# Altium project HALL_SENSOR_BOARD.PrjPCB
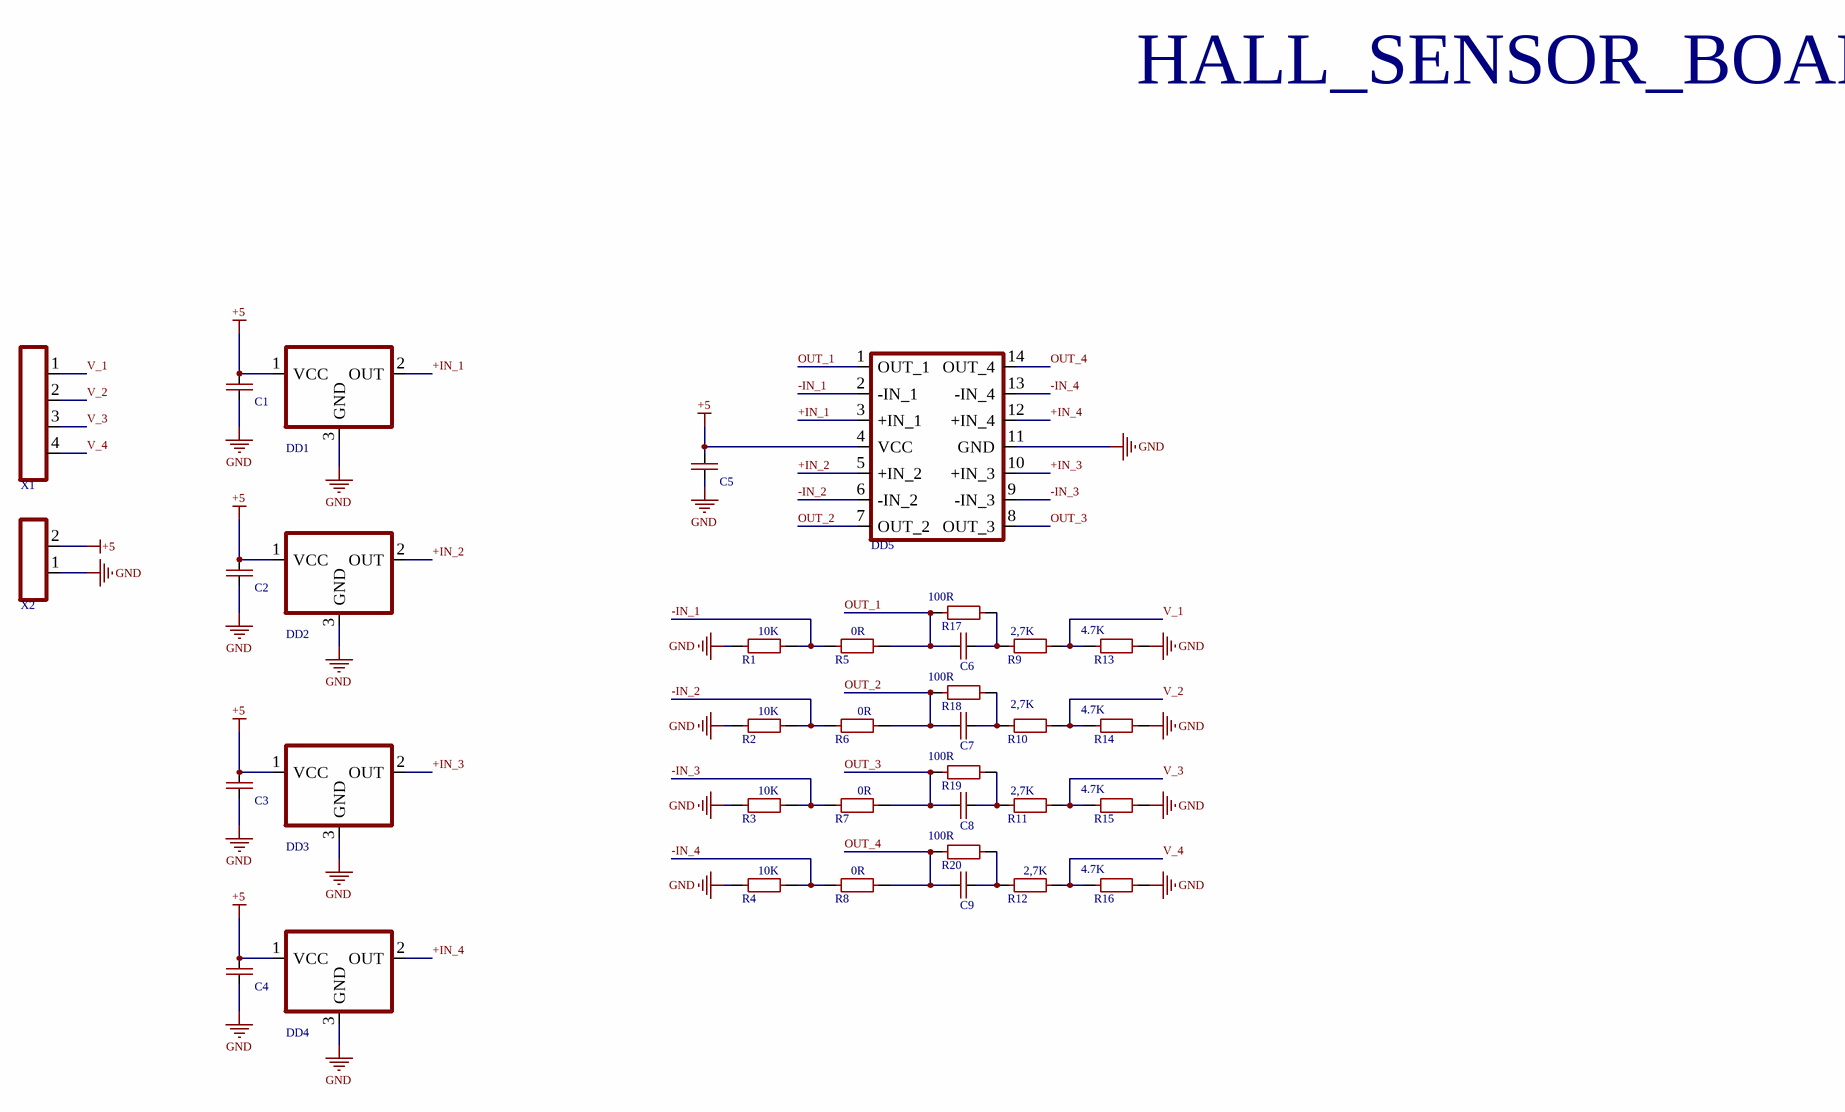
[diagram p0: HALL_SENSOR_BOARD.SchDoc]
1 sheet, 36 parts. Net scope: global (net labels, ports and power ports of the same name join across sheets).
Board file: HALL_SENSOR_BOARD.PcbDoc

## Sheet HALL_SENSOR_BOARD.SchDoc
size A1

### Parts
C1  CAP-NON-POLAR  [CAP-0805]  (value not drawn)
C2  CAP-NON-POLAR  [CAP-0805]  (value not drawn)
C3  CAP-NON-POLAR  [CAP-0805]  (value not drawn)
C4  CAP-NON-POLAR  [CAP-0805]  (value not drawn)
C5  CAP-NON-POLAR  [CAP-0805]  (value not drawn)
C6  CAP-NON-POLAR  [CAP-0805]  (value not drawn)
C7  CAP-NON-POLAR  [CAP-0805]  (value not drawn)
C8  CAP-NON-POLAR  [CAP-0805]  (value not drawn)
C9  CAP-NON-POLAR  [CAP-0805]  (value not drawn)
DD1  49E  [SOT23-3]  (value not drawn)
DD2  49E  [SOT23-3]  (value not drawn)
DD3  49E  [SOT23-3]  (value not drawn)
DD4  49E  [SOT23-3]  (value not drawn)
DD5  LM324  [SOIC14]  (value not drawn)
R1  10K  [RES-0603]
R2  10K  [RES-0603]
R3  10K  [RES-0603]
R4  10K  [RES-0603]
R5  0R  [RES-0603]
R6  0R  [RES-0603]
R7  0R  [RES-0603]
R8  0R  [RES-0603]
R9  2,7K  [RES-0603]
R10  2,7K  [RES-0603]
R11  2,7K  [RES-0603]
R12  2,7K  [RES-0603]
R13  4.7K  [RES-0603]
R14  4.7K  [RES-0603]
R15  4.7K  [RES-0603]
R16  4.7K  [RES-0603]
R17  100R  [RES-0603]
R18  100R  [RES-0603]
R19  100R  [RES-0603]
R20  100R  [RES-0603]
X1  CONN-4-PIN  [CONN-PLS-4-2.54mm]  (value not drawn)
X2  CONN-2-PIN  [CONN-PLS-2-2.54mm]  (value not drawn)

### Nets
+5: C1.2 C2.2 C3.2 C4.2 C5.2 DD1.1(VCC) DD2.1(VCC) DD3.1(VCC) DD4.1(VCC) DD5.4(VCC) X2.2
GND: C1.1 C2.1 C3.1 C4.1 C5.1 DD1.3(GND) DD2.3(GND) DD3.3(GND) DD4.3(GND) DD5.11(GND) R1.1 R2.1 R3.1 R4.1 R13.1 R14.1 R15.1 R16.1 X2.1
+IN_1: DD1.2(OUT) DD5.3(+IN_1)
+IN_2: DD2.2(OUT) DD5.5(+IN_2)
+IN_3: DD3.2(OUT) DD5.10(+IN_3)
+IN_4: DD4.2(OUT) DD5.12(+IN_4)
-IN_1: DD5.2(-IN_1) R1.2 R5.1
-IN_2: DD5.6(-IN_2) R2.2 R6.1
-IN_3: DD5.9(-IN_3) R3.2 R7.1
-IN_4: DD5.13(-IN_4) R4.2 R8.1
OUT_1: C6.2 DD5.1(OUT_1) R5.2 R17.2
OUT_2: C7.2 DD5.7(OUT_2) R6.2 R18.2
OUT_3: C8.2 DD5.8(OUT_3) R7.2 R19.2
OUT_4: C9.2 DD5.14(OUT_4) R8.2 R20.2
V_1: R9.1 R13.2 X1.1
V_2: R10.1 R14.2 X1.2
V_3: R11.1 R15.2 X1.3
V_4: R12.1 R16.2 X1.4
NetC6_1: C6.1 R9.2 R17.1
NetC7_1: C7.1 R10.2 R18.1
NetC8_1: C8.1 R11.2 R19.1
NetC9_1: C9.1 R12.2 R20.1

### Notes on the sheet
- HALL_SENSOR_BOARD

### Library data of the parts
R1-R20 = RES-CONST